# EAGLE schematic Display50_Cape (EAGLE 7.7.0)
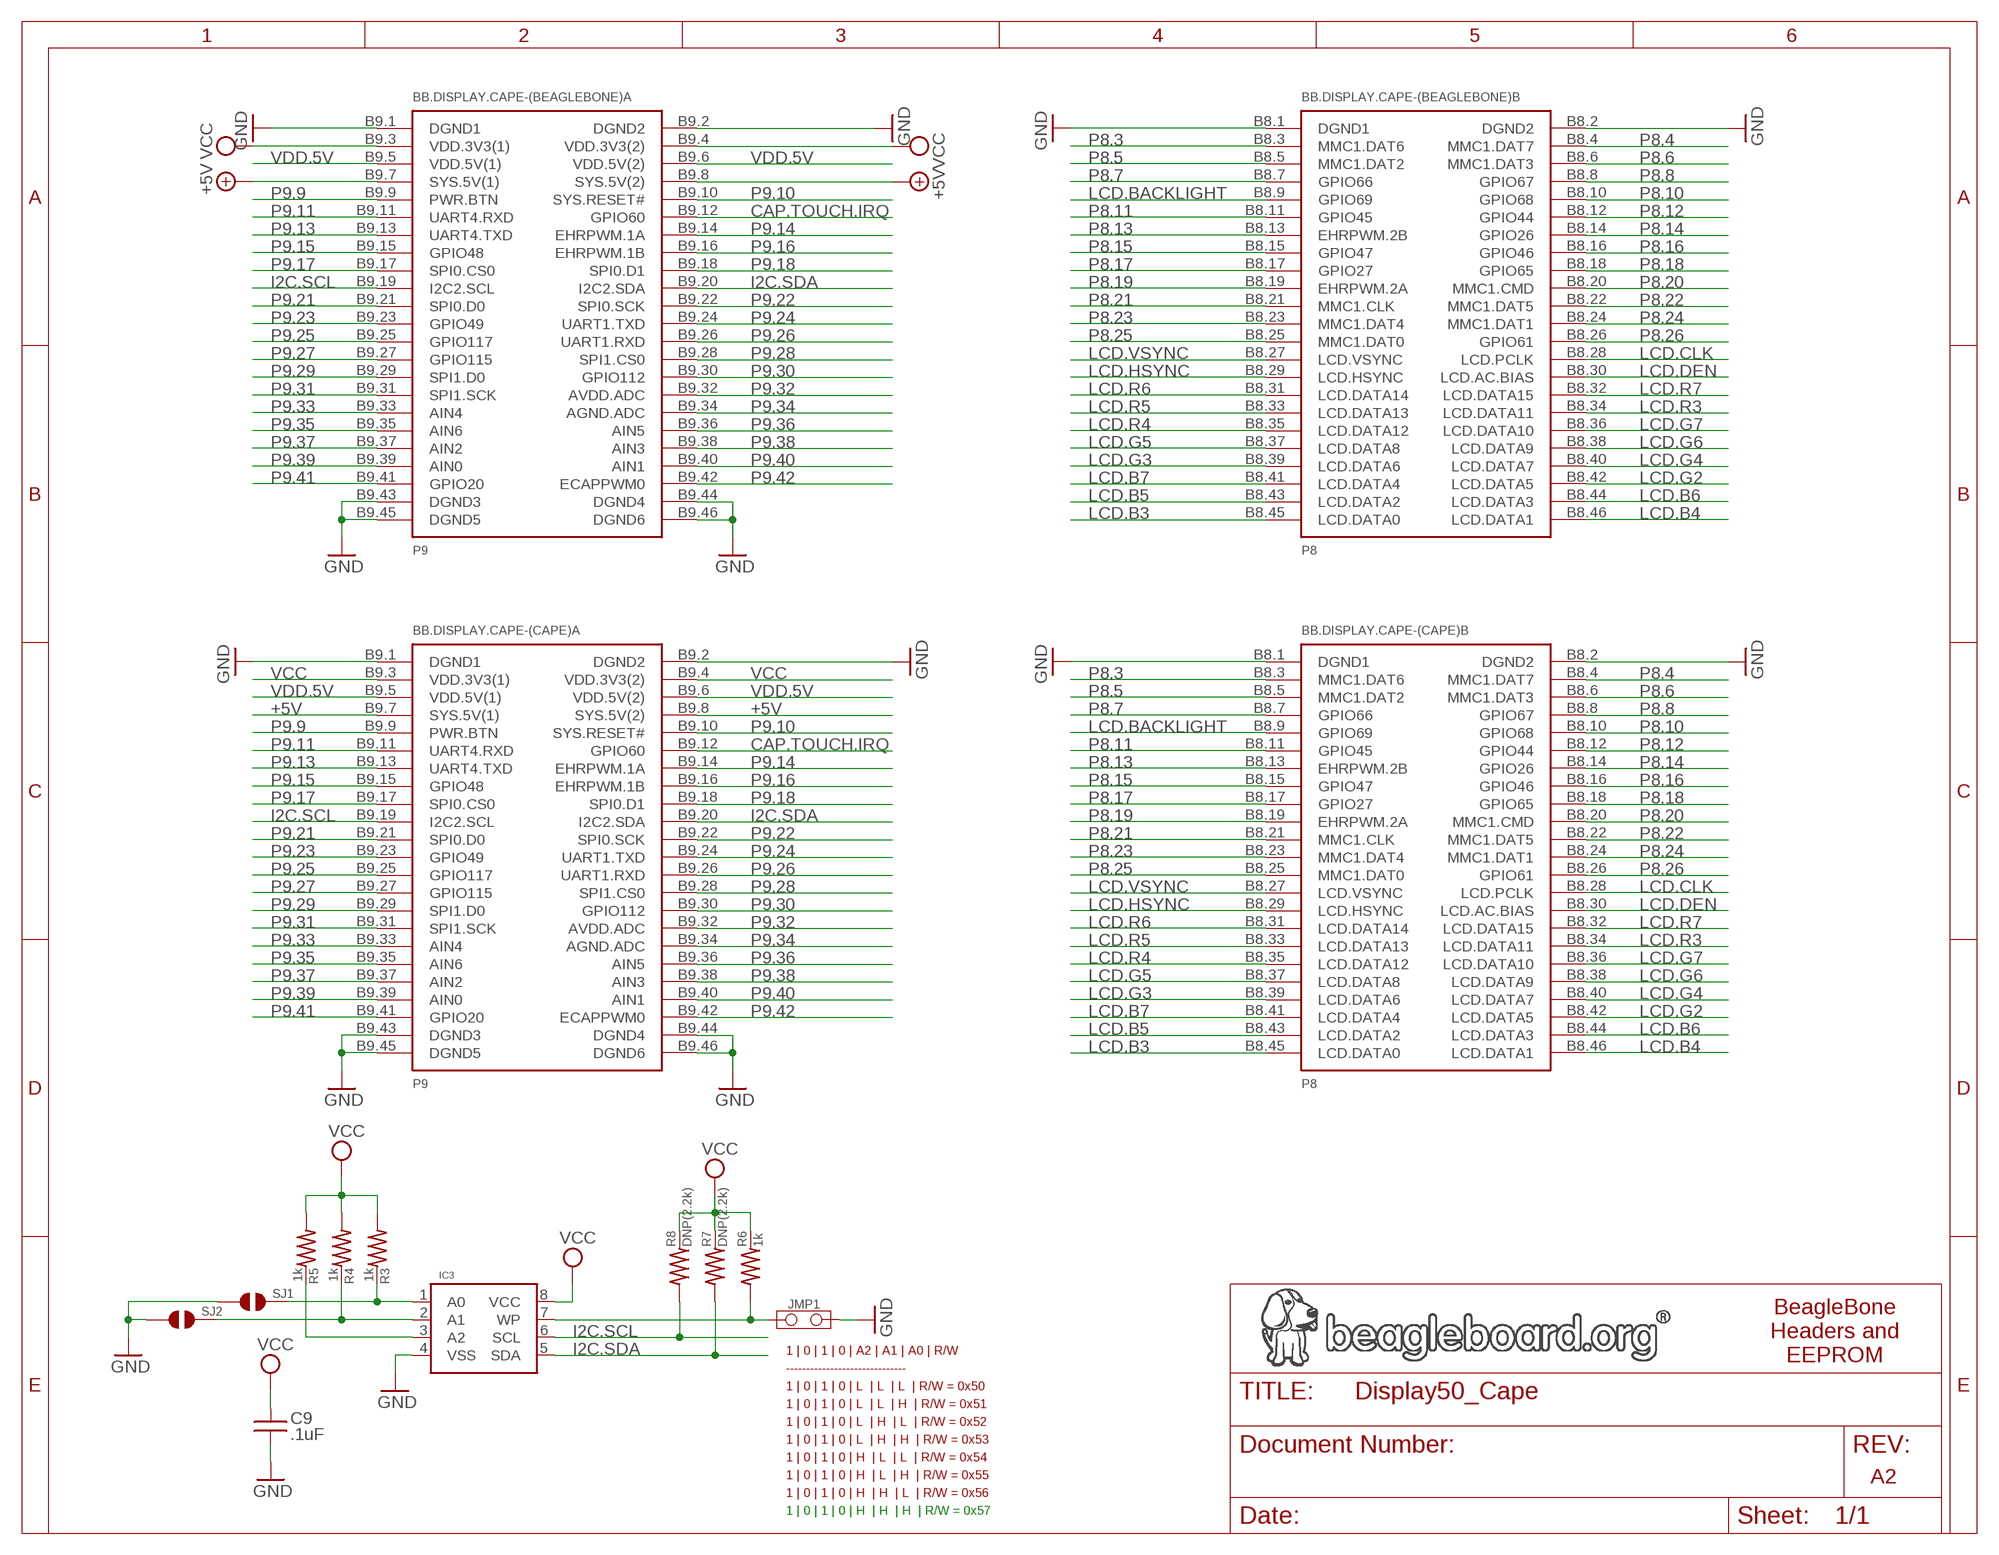
[diagram p0: schematic, sheet 1, part 1 of 2]
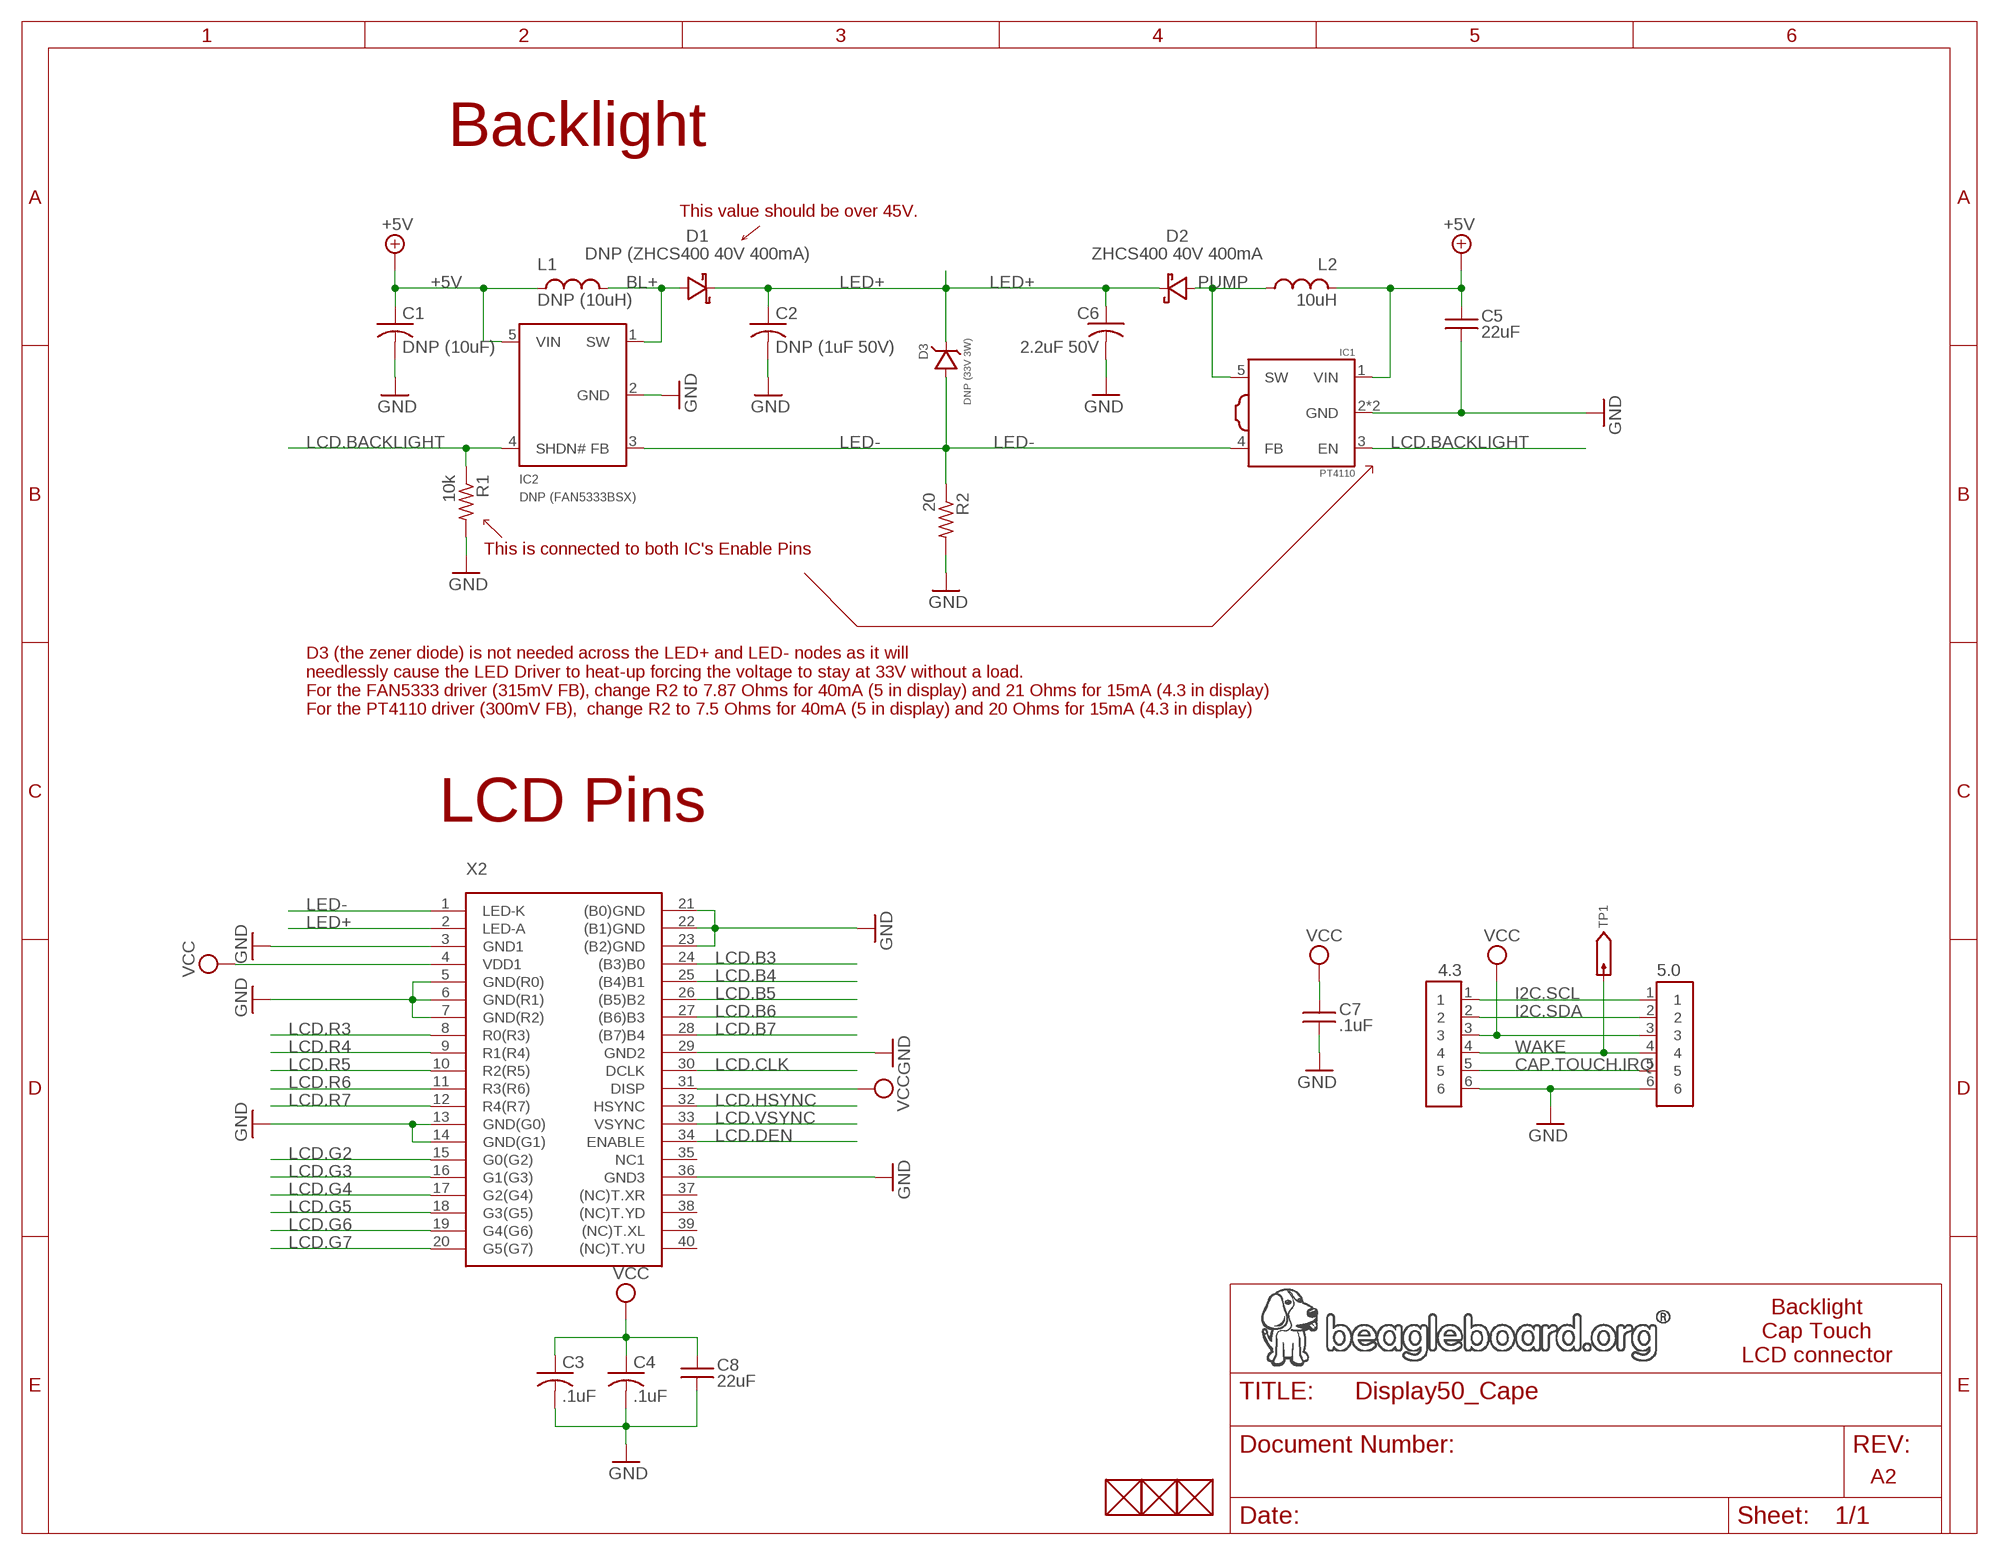
[diagram p1: schematic, sheet 1, part 2 of 2]

## Parts
4.3  6-PIN-(0.5MM-PITCH)-FPC-CONNECTOR  [6-PIN-(0.5MM-PITCH)-FPC-CONNECTOR]
5.0  6-PIN-(0.5MM-PITCH)-FPC-CONNECTOR  [6-PIN-(0.5MM-PITCH)-FPC-CONNECTOR]
BB.DISPLAY.CAPE-(BEAGLEBONE)  BEAGLEBONE.CAPE.DISPLAY-X.BEAGLEBONE  [BEAGLEBONE.CAPE.DISPLAY-X.BEAGLEBONE]
BB.DISPLAY.CAPE-(CAPE)  BEAGLEBONE.CAPE.DISPLAY-X.CAPE  [BEAGLEBONE.CAPE.DISPLAY-X.CAPE]
C1  DNP (10uF)  C-USC0603K  [C0603K]
C2  DNP (1uF 50V)  C-USC0805K  [C0805K]
C3  .1uF  C-USC0402K  [C0402K]
C4  .1uF  C-USC0402K  [C0402K]
C5  22uF  CAPACITOR-(INCH)-0805  [0805]
C6  2.2uF 50V  C-USC0805K  [C0805K]
C7  .1uF  CAPACITOR-(INCH)-0402  [0402]
C8  22uF  CAPACITOR-(INCH)-0805  [0805]
C9  .1uF  CAPACITOR-(INCH)-0402  [0402]
D1  DNP (ZHCS400 40V 400mA)  DIODE-SCHOTTKY-(NXP)-SOD323-(WAVE)  [SOD323(NXP)WAVE]
D2  ZHCS400 40V 400mA  DIODE-SCHOTTKY-(NXP)-SOD323-(WAVE)  [SOD323(NXP)WAVE]
D3  DNP (33V 3W)  DIODE-ZENER-  [SMB(ON.SEMI)]
FUD1  FIDUCIAL  [FIDUCIAL_40MIL]
FUD2  FIDUCIAL  [FIDUCIAL_40MIL]
FUD3  FIDUCIAL  [FIDUCIAL_40MIL]
IC1  PT4110  [SOT89-5(DIODES)]
IC2  DNP (FAN5333BSX)  FAN533X  [SOT23-5(FAIRCHILD)]
IC3  CAT24C32  [UDFN8,2X3(ON-SEMI)]
JMP1  JUMPER-(X2)  [JUMPER-(X2)]
L1  DNP (10uH)  INDUCTOR-(TAIYO-YUDEN)-NRS5030  [NRS(TAIYO.YUDEN)]
L2  10uH  INDUCTOR-(TAIYO-YUDEN)-NRS5030  [NRS(TAIYO.YUDEN)]
R1  10k  R-US_R0603  [R0603]
R2  20  R-US_R0603  [R0603]
R3  1k  RESISTOR-(INCH)-0402  [0402]
R4  1k  RESISTOR-(INCH)-0402  [0402]
R5  1k  RESISTOR-(INCH)-0402  [0402]
R6  1k  RESISTOR-(INCH)-0402  [0402]
R7  DNP(2.2k)  RESISTOR-(INCH)-0402  [0402]
R8  DNP(2.2k)  RESISTOR-(INCH)-0402  [0402]
SJ1  SOLDER.JOINT-(INCH)-0402  [SOLDER.JOINT(0402)]
SJ2  SOLDER.JOINT-(INCH)-0402  [SOLDER.JOINT(0402)]
TP1  TESTPAD/W_HOLE_1X1  [TESTPAD/W_HOLE_1X1]
X2  LCD-40PIN_FFC/FPC_0.5MM_PITCH  [KISD04-40_T1_E]

## Nets
+5V: BB.DISPLAY.CAPE-(BEAGLEBONE).B9.7(A:SYS.5V(1)) BB.DISPLAY.CAPE-(BEAGLEBONE).B9.8(A:SYS.5V(2)) BB.DISPLAY.CAPE-(CAPE).B9.7(A:SYS.5V(1)) BB.DISPLAY.CAPE-(CAPE).B9.8(A:SYS.5V(2)) C1.1 C5.1 IC1.1(VIN) IC2.5(VIN) L1.1 L2.1
A0: IC3.1(A0) R3.2 SJ1.2
A1: IC3.2(A1) R4.2 SJ2.2
A2: IC3.3(A2) R5.2
BL+: D1.A(ANODE) IC2.1(SW) L1.2
CAP.TOUCH.IRQ: 4.3.5 5.0.5 BB.DISPLAY.CAPE-(BEAGLEBONE).B9.12(A:GPIO60) BB.DISPLAY.CAPE-(CAPE).B9.12(A:GPIO60)
GND [power]: 4.3.6 5.0.6 BB.DISPLAY.CAPE-(BEAGLEBONE).B8.1(B:DGND1) BB.DISPLAY.CAPE-(BEAGLEBONE).B8.2(B:DGND2) BB.DISPLAY.CAPE-(BEAGLEBONE).B9.1(A:DGND1) BB.DISPLAY.CAPE-(BEAGLEBONE).B9.2(A:DGND2) BB.DISPLAY.CAPE-(BEAGLEBONE).B9.43(A:DGND3) BB.DISPLAY.CAPE-(BEAGLEBONE).B9.44(A:DGND4) BB.DISPLAY.CAPE-(BEAGLEBONE).B9.45(A:DGND5) BB.DISPLAY.CAPE-(BEAGLEBONE).B9.46(A:DGND6) BB.DISPLAY.CAPE-(CAPE).B8.1(B:DGND1) BB.DISPLAY.CAPE-(CAPE).B8.2(B:DGND2) BB.DISPLAY.CAPE-(CAPE).B9.1(A:DGND1) BB.DISPLAY.CAPE-(CAPE).B9.2(A:DGND2) BB.DISPLAY.CAPE-(CAPE).B9.43(A:DGND3) BB.DISPLAY.CAPE-(CAPE).B9.44(A:DGND4) BB.DISPLAY.CAPE-(CAPE).B9.45(A:DGND5) BB.DISPLAY.CAPE-(CAPE).B9.46(A:DGND6) C1.2 C2.2 C3.2 C4.2 C5.2 C6.2 C7.2 C8.2 C9.2 IC1.2(GND) IC1.THERMAL(GND) IC2.2(GND) IC3.4(VSS) JMP1.2 R1.2 R2.2 SJ1.1 SJ2.1 X2.3(GND1) X2.5(GND(R0)) X2.6(GND(R1)) X2.7(GND(R2)) X2.13(GND(G0)) X2.14(GND(G1)) X2.21((B0)GND) X2.22((B1)GND) X2.23((B2)GND) X2.29(GND2) X2.36(GND3)
I2C.SCL: 4.3.1 5.0.1 BB.DISPLAY.CAPE-(BEAGLEBONE).B9.19(A:I2C2.SCL) BB.DISPLAY.CAPE-(CAPE).B9.19(A:I2C2.SCL) IC3.6(SCL) R8.1
I2C.SDA: 4.3.2 5.0.2 BB.DISPLAY.CAPE-(BEAGLEBONE).B9.20(A:I2C2.SDA) BB.DISPLAY.CAPE-(CAPE).B9.20(A:I2C2.SDA) IC3.5(SDA) R7.1
LCD.B3: BB.DISPLAY.CAPE-(BEAGLEBONE).B8.45(B:LCD.DATA0) BB.DISPLAY.CAPE-(CAPE).B8.45(B:LCD.DATA0) X2.24((B3)B0)
LCD.B4: BB.DISPLAY.CAPE-(BEAGLEBONE).B8.46(B:LCD.DATA1) BB.DISPLAY.CAPE-(CAPE).B8.46(B:LCD.DATA1) X2.25((B4)B1)
LCD.B5: BB.DISPLAY.CAPE-(BEAGLEBONE).B8.43(B:LCD.DATA2) BB.DISPLAY.CAPE-(CAPE).B8.43(B:LCD.DATA2) X2.26((B5)B2)
LCD.B6: BB.DISPLAY.CAPE-(BEAGLEBONE).B8.44(B:LCD.DATA3) BB.DISPLAY.CAPE-(CAPE).B8.44(B:LCD.DATA3) X2.27((B6)B3)
LCD.B7: BB.DISPLAY.CAPE-(BEAGLEBONE).B8.41(B:LCD.DATA4) BB.DISPLAY.CAPE-(CAPE).B8.41(B:LCD.DATA4) X2.28((B7)B4)
LCD.BACKLIGHT: BB.DISPLAY.CAPE-(BEAGLEBONE).B8.9(B:GPIO69) BB.DISPLAY.CAPE-(CAPE).B8.9(B:GPIO69) IC1.3(EN) IC2.4(SHDN#) R1.1
LCD.CLK: BB.DISPLAY.CAPE-(BEAGLEBONE).B8.28(B:LCD.PCLK) BB.DISPLAY.CAPE-(CAPE).B8.28(B:LCD.PCLK) X2.30(DCLK)
LCD.DEN: BB.DISPLAY.CAPE-(BEAGLEBONE).B8.30(B:LCD.AC.BIAS) BB.DISPLAY.CAPE-(CAPE).B8.30(B:LCD.AC.BIAS) X2.34(ENABLE)
LCD.G2: BB.DISPLAY.CAPE-(BEAGLEBONE).B8.42(B:LCD.DATA5) BB.DISPLAY.CAPE-(CAPE).B8.42(B:LCD.DATA5) X2.15(G0(G2))
LCD.G3: BB.DISPLAY.CAPE-(BEAGLEBONE).B8.39(B:LCD.DATA6) BB.DISPLAY.CAPE-(CAPE).B8.39(B:LCD.DATA6) X2.16(G1(G3))
LCD.G4: BB.DISPLAY.CAPE-(BEAGLEBONE).B8.40(B:LCD.DATA7) BB.DISPLAY.CAPE-(CAPE).B8.40(B:LCD.DATA7) X2.17(G2(G4))
LCD.G5: BB.DISPLAY.CAPE-(BEAGLEBONE).B8.37(B:LCD.DATA8) BB.DISPLAY.CAPE-(CAPE).B8.37(B:LCD.DATA8) X2.18(G3(G5))
LCD.G6: BB.DISPLAY.CAPE-(BEAGLEBONE).B8.38(B:LCD.DATA9) BB.DISPLAY.CAPE-(CAPE).B8.38(B:LCD.DATA9) X2.19(G4(G6))
LCD.G7: BB.DISPLAY.CAPE-(BEAGLEBONE).B8.36(B:LCD.DATA10) BB.DISPLAY.CAPE-(CAPE).B8.36(B:LCD.DATA10) X2.20(G5(G7))
LCD.HSYNC: BB.DISPLAY.CAPE-(BEAGLEBONE).B8.29(B:LCD.HSYNC) BB.DISPLAY.CAPE-(CAPE).B8.29(B:LCD.HSYNC) X2.32(HSYNC)
LCD.R3: BB.DISPLAY.CAPE-(BEAGLEBONE).B8.34(B:LCD.DATA11) BB.DISPLAY.CAPE-(CAPE).B8.34(B:LCD.DATA11) X2.8(R0(R3))
LCD.R4: BB.DISPLAY.CAPE-(BEAGLEBONE).B8.35(B:LCD.DATA12) BB.DISPLAY.CAPE-(CAPE).B8.35(B:LCD.DATA12) X2.9(R1(R4))
LCD.R5: BB.DISPLAY.CAPE-(BEAGLEBONE).B8.33(B:LCD.DATA13) BB.DISPLAY.CAPE-(CAPE).B8.33(B:LCD.DATA13) X2.10(R2(R5))
LCD.R6: BB.DISPLAY.CAPE-(BEAGLEBONE).B8.31(B:LCD.DATA14) BB.DISPLAY.CAPE-(CAPE).B8.31(B:LCD.DATA14) X2.11(R3(R6))
LCD.R7: BB.DISPLAY.CAPE-(BEAGLEBONE).B8.32(B:LCD.DATA15) BB.DISPLAY.CAPE-(CAPE).B8.32(B:LCD.DATA15) X2.12(R4(R7))
LCD.VSYNC: BB.DISPLAY.CAPE-(BEAGLEBONE).B8.27(B:LCD.VSYNC) BB.DISPLAY.CAPE-(CAPE).B8.27(B:LCD.VSYNC) X2.33(VSYNC)
LED+: C2.1 C6.1 D1.C(CATHODE) D2.C(CATHODE) D3.K X2.2(LED-A)
LED-: D3.A IC1.4(FB) IC2.3(FB) R2.1 X2.1(LED-K)
P8.3: BB.DISPLAY.CAPE-(BEAGLEBONE).B8.3(B:MMC1.DAT6) BB.DISPLAY.CAPE-(CAPE).B8.3(B:MMC1.DAT6)
P8.4: BB.DISPLAY.CAPE-(BEAGLEBONE).B8.4(B:MMC1.DAT7) BB.DISPLAY.CAPE-(CAPE).B8.4(B:MMC1.DAT7)
P8.5: BB.DISPLAY.CAPE-(BEAGLEBONE).B8.5(B:MMC1.DAT2) BB.DISPLAY.CAPE-(CAPE).B8.5(B:MMC1.DAT2)
P8.6: BB.DISPLAY.CAPE-(BEAGLEBONE).B8.6(B:MMC1.DAT3) BB.DISPLAY.CAPE-(CAPE).B8.6(B:MMC1.DAT3)
P8.7: BB.DISPLAY.CAPE-(BEAGLEBONE).B8.7(B:GPIO66) BB.DISPLAY.CAPE-(CAPE).B8.7(B:GPIO66)
P8.8: BB.DISPLAY.CAPE-(BEAGLEBONE).B8.8(B:GPIO67) BB.DISPLAY.CAPE-(CAPE).B8.8(B:GPIO67)
P8.10: BB.DISPLAY.CAPE-(BEAGLEBONE).B8.10(B:GPIO68) BB.DISPLAY.CAPE-(CAPE).B8.10(B:GPIO68)
P8.11: BB.DISPLAY.CAPE-(BEAGLEBONE).B8.11(B:GPIO45) BB.DISPLAY.CAPE-(CAPE).B8.11(B:GPIO45)
P8.12: BB.DISPLAY.CAPE-(BEAGLEBONE).B8.12(B:GPIO44) BB.DISPLAY.CAPE-(CAPE).B8.12(B:GPIO44)
P8.13: BB.DISPLAY.CAPE-(BEAGLEBONE).B8.13(B:EHRPWM.2B) BB.DISPLAY.CAPE-(CAPE).B8.13(B:EHRPWM.2B)
P8.14: BB.DISPLAY.CAPE-(BEAGLEBONE).B8.14(B:GPIO26) BB.DISPLAY.CAPE-(CAPE).B8.14(B:GPIO26)
P8.15: BB.DISPLAY.CAPE-(BEAGLEBONE).B8.15(B:GPIO47) BB.DISPLAY.CAPE-(CAPE).B8.15(B:GPIO47)
P8.16: BB.DISPLAY.CAPE-(BEAGLEBONE).B8.16(B:GPIO46) BB.DISPLAY.CAPE-(CAPE).B8.16(B:GPIO46)
P8.17: BB.DISPLAY.CAPE-(BEAGLEBONE).B8.17(B:GPIO27) BB.DISPLAY.CAPE-(CAPE).B8.17(B:GPIO27)
P8.18: BB.DISPLAY.CAPE-(BEAGLEBONE).B8.18(B:GPIO65) BB.DISPLAY.CAPE-(CAPE).B8.18(B:GPIO65)
P8.19: BB.DISPLAY.CAPE-(BEAGLEBONE).B8.19(B:EHRPWM.2A) BB.DISPLAY.CAPE-(CAPE).B8.19(B:EHRPWM.2A)
P8.20: BB.DISPLAY.CAPE-(BEAGLEBONE).B8.20(B:MMC1.CMD) BB.DISPLAY.CAPE-(CAPE).B8.20(B:MMC1.CMD)
P8.21: BB.DISPLAY.CAPE-(BEAGLEBONE).B8.21(B:MMC1.CLK) BB.DISPLAY.CAPE-(CAPE).B8.21(B:MMC1.CLK)
P8.22: BB.DISPLAY.CAPE-(BEAGLEBONE).B8.22(B:MMC1.DAT5) BB.DISPLAY.CAPE-(CAPE).B8.22(B:MMC1.DAT5)
P8.23: BB.DISPLAY.CAPE-(BEAGLEBONE).B8.23(B:MMC1.DAT4) BB.DISPLAY.CAPE-(CAPE).B8.23(B:MMC1.DAT4)
P8.24: BB.DISPLAY.CAPE-(BEAGLEBONE).B8.24(B:MMC1.DAT1) BB.DISPLAY.CAPE-(CAPE).B8.24(B:MMC1.DAT1)
P8.25: BB.DISPLAY.CAPE-(BEAGLEBONE).B8.25(B:MMC1.DAT0) BB.DISPLAY.CAPE-(CAPE).B8.25(B:MMC1.DAT0)
P8.26: BB.DISPLAY.CAPE-(BEAGLEBONE).B8.26(B:GPIO61) BB.DISPLAY.CAPE-(CAPE).B8.26(B:GPIO61)
P9.9: BB.DISPLAY.CAPE-(BEAGLEBONE).B9.9(A:PWR.BTN) BB.DISPLAY.CAPE-(CAPE).B9.9(A:PWR.BTN)
P9.10: BB.DISPLAY.CAPE-(BEAGLEBONE).B9.10(A:SYS.RESET#) BB.DISPLAY.CAPE-(CAPE).B9.10(A:SYS.RESET#)
P9.11: BB.DISPLAY.CAPE-(BEAGLEBONE).B9.11(A:UART4.RXD) BB.DISPLAY.CAPE-(CAPE).B9.11(A:UART4.RXD)
P9.13: BB.DISPLAY.CAPE-(BEAGLEBONE).B9.13(A:UART4.TXD) BB.DISPLAY.CAPE-(CAPE).B9.13(A:UART4.TXD)
P9.14: BB.DISPLAY.CAPE-(BEAGLEBONE).B9.14(A:EHRPWM.1A) BB.DISPLAY.CAPE-(CAPE).B9.14(A:EHRPWM.1A)
P9.15: BB.DISPLAY.CAPE-(BEAGLEBONE).B9.15(A:GPIO48) BB.DISPLAY.CAPE-(CAPE).B9.15(A:GPIO48)
P9.16: BB.DISPLAY.CAPE-(BEAGLEBONE).B9.16(A:EHRPWM.1B) BB.DISPLAY.CAPE-(CAPE).B9.16(A:EHRPWM.1B)
P9.17: BB.DISPLAY.CAPE-(BEAGLEBONE).B9.17(A:SPI0.CS0) BB.DISPLAY.CAPE-(CAPE).B9.17(A:SPI0.CS0)
P9.18: BB.DISPLAY.CAPE-(BEAGLEBONE).B9.18(A:SPI0.D1) BB.DISPLAY.CAPE-(CAPE).B9.18(A:SPI0.D1)
P9.21: BB.DISPLAY.CAPE-(BEAGLEBONE).B9.21(A:SPI0.D0) BB.DISPLAY.CAPE-(CAPE).B9.21(A:SPI0.D0)
P9.22: BB.DISPLAY.CAPE-(BEAGLEBONE).B9.22(A:SPI0.SCK) BB.DISPLAY.CAPE-(CAPE).B9.22(A:SPI0.SCK)
P9.23: BB.DISPLAY.CAPE-(BEAGLEBONE).B9.23(A:GPIO49) BB.DISPLAY.CAPE-(CAPE).B9.23(A:GPIO49)
P9.24: BB.DISPLAY.CAPE-(BEAGLEBONE).B9.24(A:UART1.TXD) BB.DISPLAY.CAPE-(CAPE).B9.24(A:UART1.TXD)
P9.25: BB.DISPLAY.CAPE-(BEAGLEBONE).B9.25(A:GPIO117) BB.DISPLAY.CAPE-(CAPE).B9.25(A:GPIO117)
P9.26: BB.DISPLAY.CAPE-(BEAGLEBONE).B9.26(A:UART1.RXD) BB.DISPLAY.CAPE-(CAPE).B9.26(A:UART1.RXD)
P9.27: BB.DISPLAY.CAPE-(BEAGLEBONE).B9.27(A:GPIO115) BB.DISPLAY.CAPE-(CAPE).B9.27(A:GPIO115)
P9.28: BB.DISPLAY.CAPE-(BEAGLEBONE).B9.28(A:SPI1.CS0) BB.DISPLAY.CAPE-(CAPE).B9.28(A:SPI1.CS0)
P9.29: BB.DISPLAY.CAPE-(BEAGLEBONE).B9.29(A:SPI1.D0) BB.DISPLAY.CAPE-(CAPE).B9.29(A:SPI1.D0)
P9.30: BB.DISPLAY.CAPE-(BEAGLEBONE).B9.30(A:GPIO112) BB.DISPLAY.CAPE-(CAPE).B9.30(A:GPIO112)
P9.31: BB.DISPLAY.CAPE-(BEAGLEBONE).B9.31(A:SPI1.SCK) BB.DISPLAY.CAPE-(CAPE).B9.31(A:SPI1.SCK)
P9.32: BB.DISPLAY.CAPE-(BEAGLEBONE).B9.32(A:AVDD.ADC) BB.DISPLAY.CAPE-(CAPE).B9.32(A:AVDD.ADC)
P9.33: BB.DISPLAY.CAPE-(BEAGLEBONE).B9.33(A:AIN4) BB.DISPLAY.CAPE-(CAPE).B9.33(A:AIN4)
P9.34: BB.DISPLAY.CAPE-(BEAGLEBONE).B9.34(A:AGND.ADC) BB.DISPLAY.CAPE-(CAPE).B9.34(A:AGND.ADC)
P9.35: BB.DISPLAY.CAPE-(BEAGLEBONE).B9.35(A:AIN6) BB.DISPLAY.CAPE-(CAPE).B9.35(A:AIN6)
P9.36: BB.DISPLAY.CAPE-(BEAGLEBONE).B9.36(A:AIN5) BB.DISPLAY.CAPE-(CAPE).B9.36(A:AIN5)
P9.37: BB.DISPLAY.CAPE-(BEAGLEBONE).B9.37(A:AIN2) BB.DISPLAY.CAPE-(CAPE).B9.37(A:AIN2)
P9.38: BB.DISPLAY.CAPE-(BEAGLEBONE).B9.38(A:AIN3) BB.DISPLAY.CAPE-(CAPE).B9.38(A:AIN3)
P9.39: BB.DISPLAY.CAPE-(BEAGLEBONE).B9.39(A:AIN0) BB.DISPLAY.CAPE-(CAPE).B9.39(A:AIN0)
P9.40: BB.DISPLAY.CAPE-(BEAGLEBONE).B9.40(A:AIN1) BB.DISPLAY.CAPE-(CAPE).B9.40(A:AIN1)
P9.41: BB.DISPLAY.CAPE-(BEAGLEBONE).B9.41(A:GPIO20) BB.DISPLAY.CAPE-(CAPE).B9.41(A:GPIO20)
P9.42: BB.DISPLAY.CAPE-(BEAGLEBONE).B9.42(A:ECAPPWM0) BB.DISPLAY.CAPE-(CAPE).B9.42(A:ECAPPWM0)
PUMP: D2.A(ANODE) IC1.5(SW) L2.2
VCC: 4.3.3 5.0.3 BB.DISPLAY.CAPE-(BEAGLEBONE).B9.3(A:VDD.3V3(1)) BB.DISPLAY.CAPE-(BEAGLEBONE).B9.4(A:VDD.3V3(2)) BB.DISPLAY.CAPE-(CAPE).B9.3(A:VDD.3V3(1)) BB.DISPLAY.CAPE-(CAPE).B9.4(A:VDD.3V3(2)) C3.1 C4.1 C7.1 C8.1 C9.1 IC3.8(VCC) R3.1 R4.1 R5.1 R6.2 R7.2 R8.2 X2.4(VDD1) X2.31(DISP)
VDD.5V: BB.DISPLAY.CAPE-(BEAGLEBONE).B9.5(A:VDD.5V(1)) BB.DISPLAY.CAPE-(BEAGLEBONE).B9.6(A:VDD.5V(2)) BB.DISPLAY.CAPE-(CAPE).B9.5(A:VDD.5V(1)) BB.DISPLAY.CAPE-(CAPE).B9.6(A:VDD.5V(2))
WAKE: 4.3.4 5.0.4 TP1.P$1(TP)
WP: IC3.7(WP) JMP1.1 R6.1
Unconnected: FUD1.P$1 FUD2.P$1 FUD3.P$1 X2.35(NC1) X2.37((NC)T.XR) X2.38((NC)T.YD) X2.39((NC)T.XL) X2.40((NC)T.YU)

## Notes on the sheet
- Backlight
- This value should be over 45V.
- This is connected to both IC's Enable Pins
- D3 (the zener diode) is not needed across the LED+ and LED- nodes as it will
  needlessly cause the LED Driver to heat-up forcing the voltage to stay at 33V without a load.
  For the FAN5333 driver (315mV FB), change R2 to 7.87 Ohms for 40mA (5 in display) and 21 Ohms for 15mA (4.3 in display)
  For the PT4110 driver (300mV FB),  change R2 to 7.5 Ohms for 40mA (5 in display) and 20 Ohms for 15mA (4.3 in display)
- LCD Pins
- 1 | 0 | 1 | 0 | A2 | A1 | A0 | R/W
- BeagleBone
  Headers and
  EEPROM
- Backlight
  Cap Touch
  LCD connector
- ------------------------------
- 1 | 0 | 1 | 0 | L  | L  | L  | R/W = 0x50
- 1 | 0 | 1 | 0 | L  | L  | H  | R/W = 0x51
- 1 | 0 | 1 | 0 | L  | H  | L  | R/W = 0x52
- 1 | 0 | 1 | 0 | L  | H  | H  | R/W = 0x53
- 1 | 0 | 1 | 0 | H  | L  | L  | R/W = 0x54
- A2 | A2
- 1 | 0 | 1 | 0 | H  | L  | H  | R/W = 0x55
- 1 | 0 | 1 | 0 | H  | H  | L  | R/W = 0x56
- 1 | 0 | 1 | 0 | H  | H  | H  | R/W = 0x57

## Library data of the parts
4.3 5.0 = GHI-Connectors:6-PIN-(0.5MM-PITCH)-FPC-CONNECTOR
BB.DISPLAY.CAPE-(BEAGLEBONE) BB.DISPLAY.CAPE-(CAPE) = GHI-Solutions:BEAGLEBONE.CAPE
C1-C4 C6 = rcl:C-US: CAPACITOR, American symbol
C5 C7-C9 = GHI-BasicComponents:CAPACITOR-(INCH)-: Basic SMD ceramic capacitors
D1 D2 = GHI-BasicComponents:DIODE-SCHOTTKY-(NXP)-
D3 = GHI-BasicComponents:DIODE-ZENER-
FUD1-FUD3 = GHI:FIDUCIAL
IC1 = GHI-IC:PT4110: High Efficiency White LED Driver
IC2 = GHI-IC:FAN533X: High Efficiency, High Current Serial LED Driver with 30V Integrated Switch
IC3 = GHI-IC:CAT24C32: 32-Kb I2C CMOS Serial EEPROM
JMP1 = GHI-Headers:JUMPER-(X2)
L1 L2 = GHI-BasicComponents:INDUCTOR-(TAIYO-YUDEN)-NRS
R1 R2 = rcl:R-US_: RESISTOR, American symbol
R3-R8 = GHI-BasicComponents:RESISTOR-(INCH)-: Basic SMD Resistors
SJ1 SJ2 = GHI-Miscellaneous:SOLDER.JOINT-(INCH)-: Solder Joint (Bridge) Pads - For easy solder joining.
TP1 = GHI2:TESTPAD/W_HOLE_1X1
X2 = GHI-VisualComponents:LCD-40PIN_FFC/FPC_0.5MM_PITCH